# EasyEDA schematic SCH_drsSolderStation_2022-02-12.json
TITLE: Sheet_1; REV: 1.0; Date: 2022-02-06; Sheet: 1/1; Drawn By: Daras Satanowski; Company: Your Company
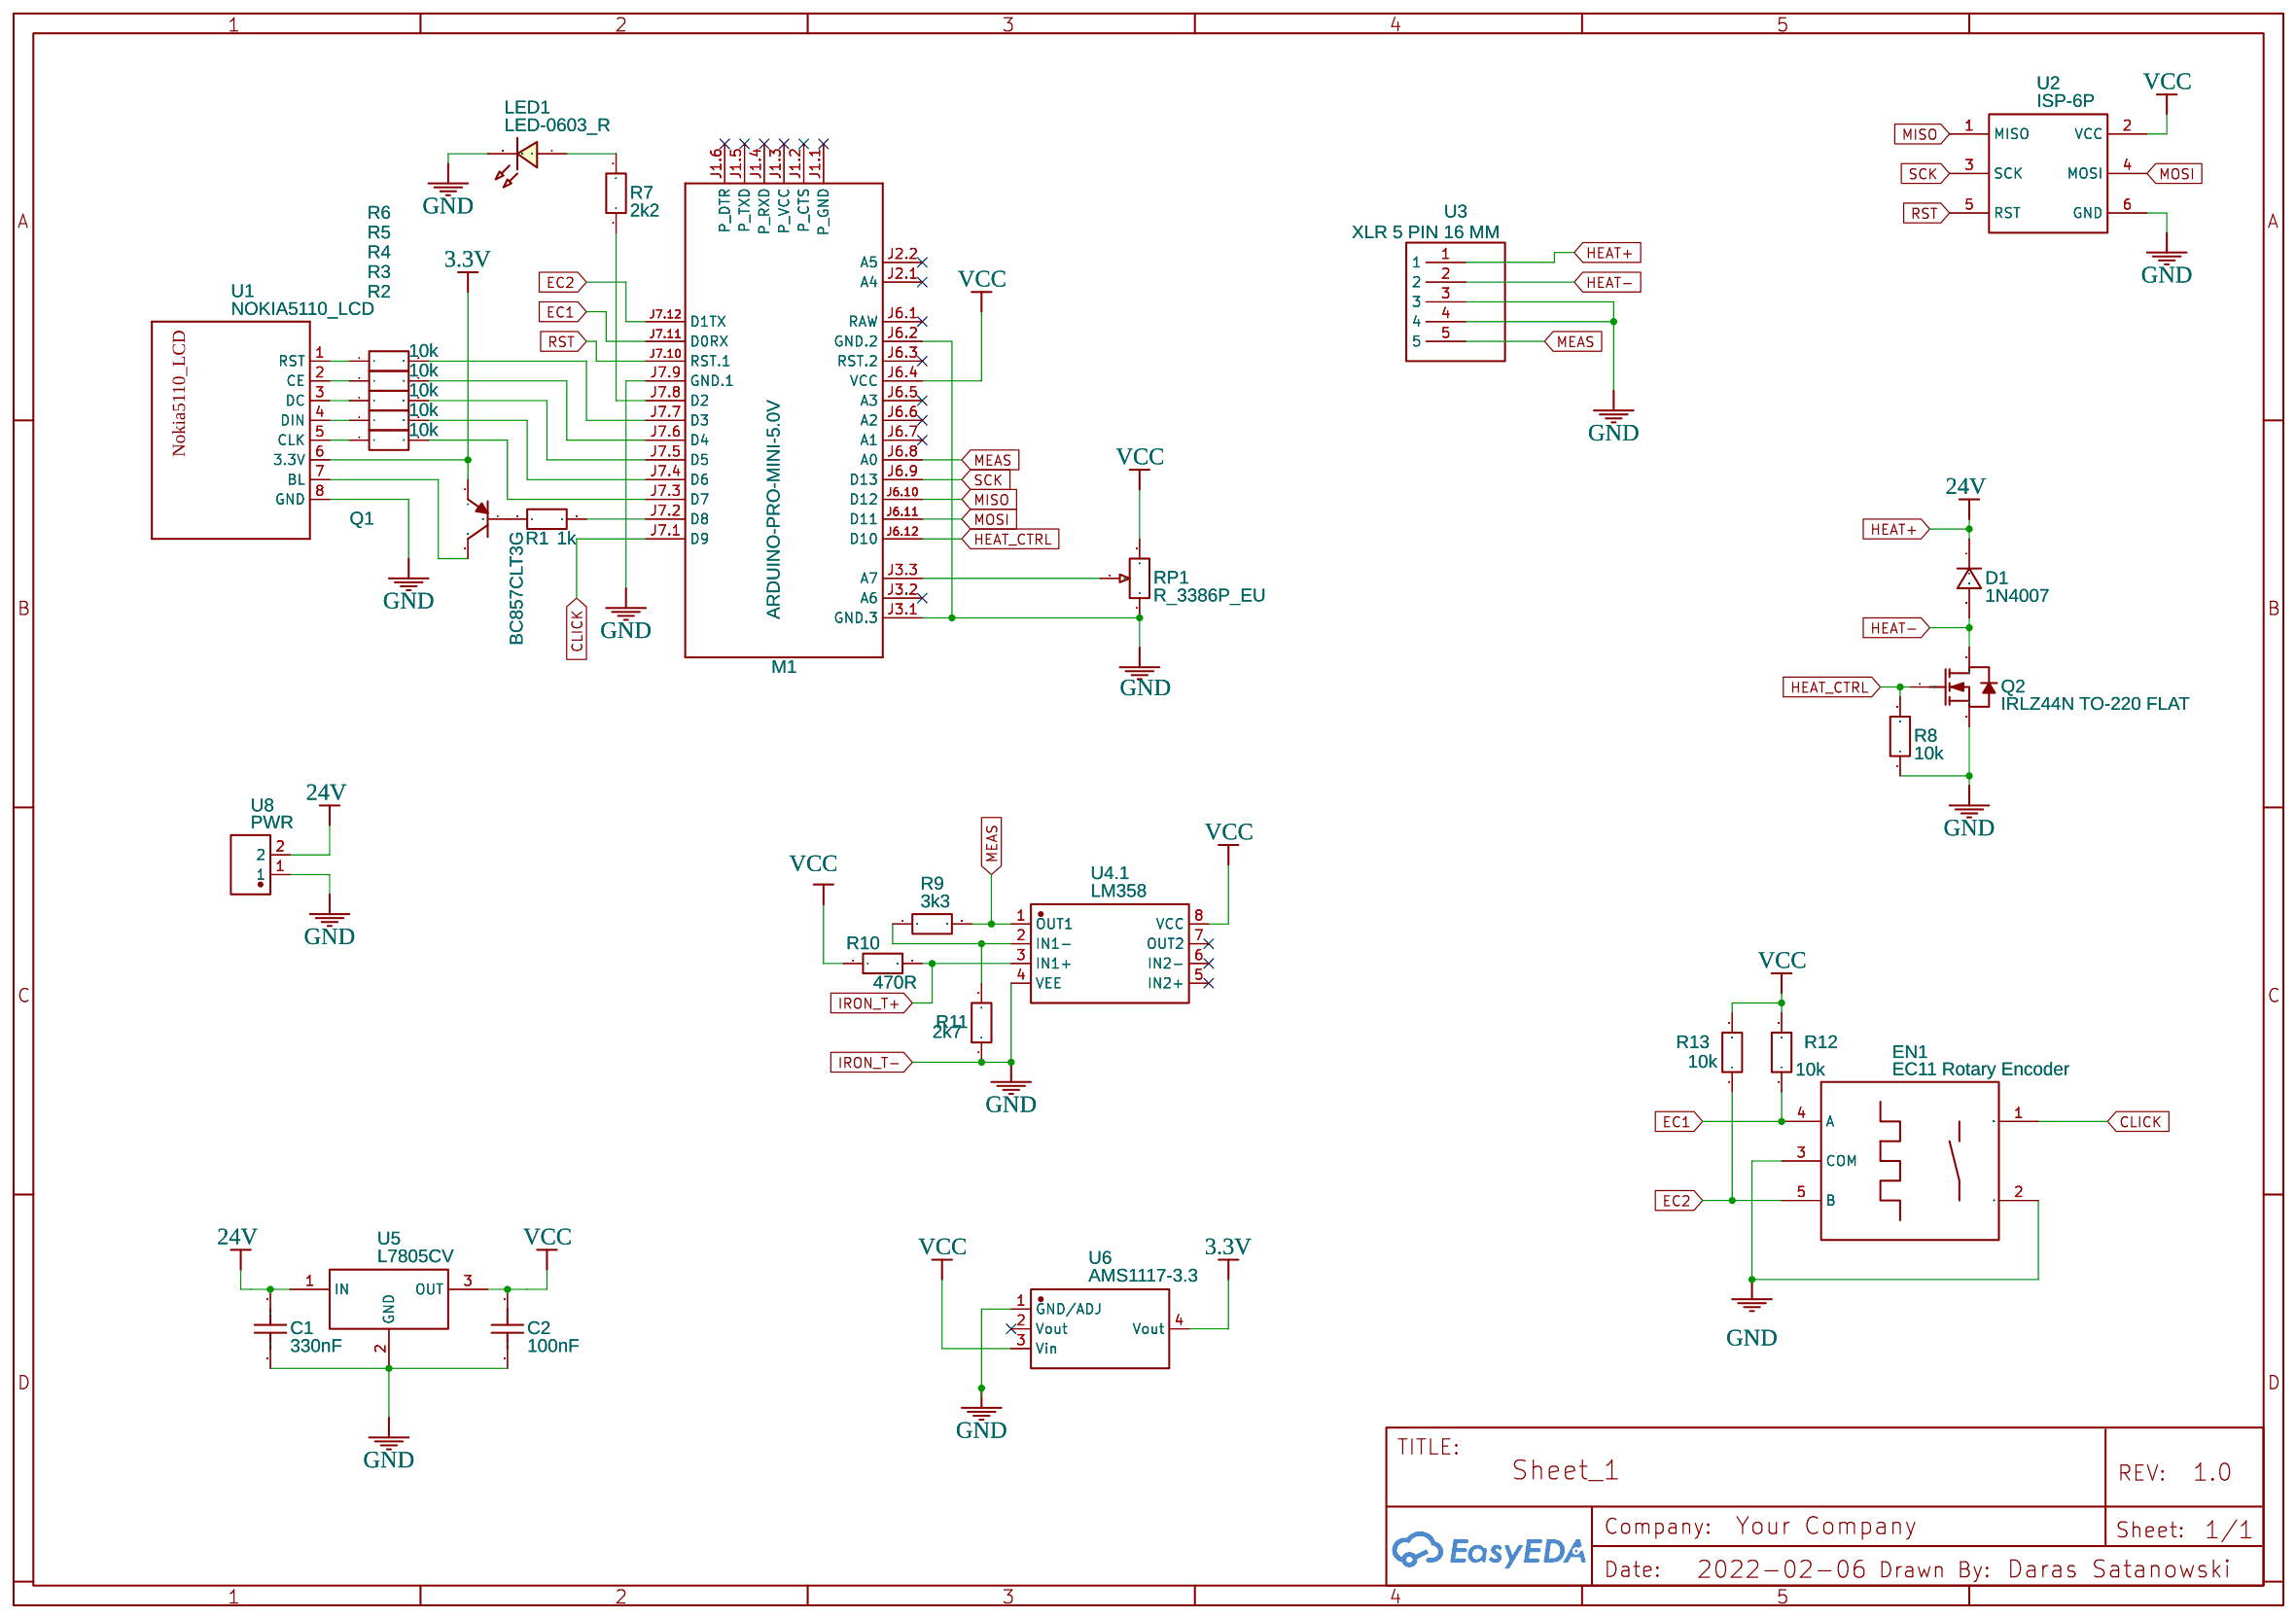
[diagram p0: schematic sheet]

## Parts
C1  330nF  [C0805]
C2  100nF  [C0805]
D1  1N4007  [DO-41_BD2.4-L4.7-P8.70-D0.9-RD]
EN1  EC11 Rotary Encoder  [ROTARY ENCODER]
LED1  LED-0603_R  [LED0805_RED]
M1  ARDUINO-PRO-MINI-5.0V  [ARDUINO-PRO-MINI]
Q1  BC857CLT3G  [SOT-23-3_L2.9-W1.3-P1.90-LS2.4-BR]
Q2  IRLZ44N TO-220 FLAT  [TO-220-3_FLAT]
R1  1k  [R0805]
R2  10k  [R0805]
R3  10k  [R0805]
R4  10k  [R0805]
R5  10k  [R0805]
R6  10k  [R0805]
R7  2k2  [R0805]
R8  10k  [R0805]
R9  3k3  [R0805]
R10  470R  [R0805]
R11  2k7  [R0805]
R12  10k  [R0805]
R13  10k  [R0805]
RP1  R_3386P_EU  [POTENTIOMETER_TRIMMER_BOURNS_3224J]
U1  NOKIA5110_LCD  [DISPLAY-NOKIA-5110]
U2  ISP-6P  [ISP-6P]
U3  XLR 5 PIN 16 MM  [XLR 5 PIN 16 MM]
U4  LM358  [SOP-8_L4.9-W3.9-P1.27-LS6.0-BL]  (section 1)
U5  L7805CV  [TO-220-3_FLAT]
U6  AMS1117-3.3  [SOT-223-3_L6.5-W3.4-P2.30-LS7.0-BR]
U8  PWR  [CONN-TH_DB125-2.54-2P-GN]

## Library data of the parts
C1 C2 = C_0805_US: Contributor: LCEDA_Lib
D1 = 1N4007: Supplier: LCSC; Manufacturer: SEMTECH; Supplier Part: C106903; Contributor: LCEDA_Lib
EN1 = EC11 Rotary Encoder: Contributor: sebastianus
LED1 = LED-0603_R: Manufacturer: EVERLIGHT(台湾亿光); Manufacturer Part: 19-217/R6C-AL1M2VY/3T; Supplier Part: C72044; Supplier: LCSC; Contributor: LCEDA_01
M1 = ARDUINO-PRO-MINI-5.0V: Arduino Pro Mini
Q1 = BC857CLT3G: Supplier: LCSC; Supplier Part: C896681; Manufacturer: onsemi(安森美); Contributor: LCSC
Q2 = IRLZ44N TO-220 FLAT: Supplier: LCSC; Manufacturer: IR; Manufacturer Part: IRLZ44NPBF; Supplier Part: C38774
R1-R13 = R_0603_EU: Contributor: LCEDA_Lib
RP1 = R_3386P_EU: Supplier: LCSC; Contributor: LCEDA_Lib; Value(Ω): 10K
U1 = NOKIA5110_LCD: Contributor: SparkFun
U2 = ISP-6P: Contributor: lukasztolak; sourceId: fd7NjBTzs
U3 = XLR 5 PIN 16 MM: Contributor: jalilurrehman
U4 = LM358: Supplier: LCSC; Supplier Part: C328566; Manufacturer: BLUE ROCKET; Contributor: LCSC; JLCPCB Part Class: Extended Part; subpart_no: 1
U5 = L7805CV: Supplier: LCSC; Manufacturer: STMicroelectronics; Supplier Part: C111887; JLCPCB Part Class: Extended Part
U6 = AMS1117-3.3: sourceId: dwIGgezVh; Supplier: LCSC; Manufacturer: AMS; Supplier Part: C6186; JLCPCB Part Class: Basic Part
U8 = DB125-2.54-2P-GN: Supplier: LCSC; Supplier Part: C918120; Manufacturer: DIBO(地博电子); Contributor: LCSC; JLCPCB Part Class: Extended Part

## Nets
3.3V: Q1.2(E) U1.6(3.3V) U6.4(Vout)
24V: C1.2 D1.1 U3.1 U5.1(IN) U8.2
GND: C1.1 C2.1 EN1.2 EN1.3(COM) LED1.2 M1.J3.1(GND.3) M1.J6.2(GND.2) M1.J7.9(GND.1) Q2.3(S) R8.1 R11.1 RP1.1 U1.8(GND) U2.6(GND) U3.3 U3.4 U4.4(VEE) U5.2(GND) U6.1(GND/ADJ) U8.1
VCC: C2.2 M1.J6.4(VCC) R10.1 R12.2 R13.2 RP1.3 U2.2(VCC) U4.8(VCC) U5.3(OUT) U6.3(Vin)
CLICK: EN1.1(SWA) M1.J7.1(D9)
EC1: EN1.4(A) M1.J7.11(D0RX) R12.1
EC2: EN1.5(B) M1.J7.12(D1TX) R13.1
HEAT-: D1.2 Q2.2(D) U3.2
HEAT_CTRL: M1.J6.12(D10) Q2.1(G) R8.2
IRON_T+: R10.2 U4.3(IN1+)
MEAS: M1.J6.8(A0) R9.2 U3.5 U4.1(OUT1)
MISO: M1.J6.10(D12) U2.1(MISO)
MOSI: M1.J6.11(D11) U2.4(MOSI)
RST: M1.J7.10(RST.1) U2.5(RST)
SCK: M1.J6.9(D13) U2.3(SCK)
Net-(LED1-1): LED1.1 R7.2
Net-(M1-J3.3): M1.J3.3(A7) RP1.2
Net-(M1-J7.2): M1.J7.2(D8) R1.2
Net-(M1-J7.3): M1.J7.3(D7) R2.2
Net-(M1-J7.4): M1.J7.4(D6) R3.2
Net-(M1-J7.5): M1.J7.5(D5) R4.2
Net-(M1-J7.6): M1.J7.6(D4) R5.2
Net-(M1-J7.7): M1.J7.7(D3) R6.2
Net-(M1-J7.8): M1.J7.8(D2) R7.1
Net-(Q1-1): Q1.1(B) R1.1
Net-(Q1-3): Q1.3(C) U1.7(BL)
Net-(R2-1): R2.1 U1.5(CLK)
Net-(R3-1): R3.1 U1.4(DIN)
Net-(R4-1): R4.1 U1.3(DC)
Net-(R5-1): R5.1 U1.2(CE)
Net-(R6-1): R6.1 U1.1(RST)
Net-(R9-1): R9.1 R11.2 U4.2(IN1-)

Not connected (* = marked no-connect by the designer): M1 J1.1(P_GND)* J1.2(P_CTS)* J1.3(P_VCC)* J1.4(P_RXD)* J1.5(P_TXD)* J1.6(P_DTR)* J2.1(A4)* J2.2(A5)* J3.2(A6)* J6.1(RAW)* J6.3(RST.2)* J6.5(A3)* J6.6(A2)* J6.7(A1)*; U4 5(IN2+)* 6(IN2-)* 7(OUT2)*; U6 2(Vout)*
